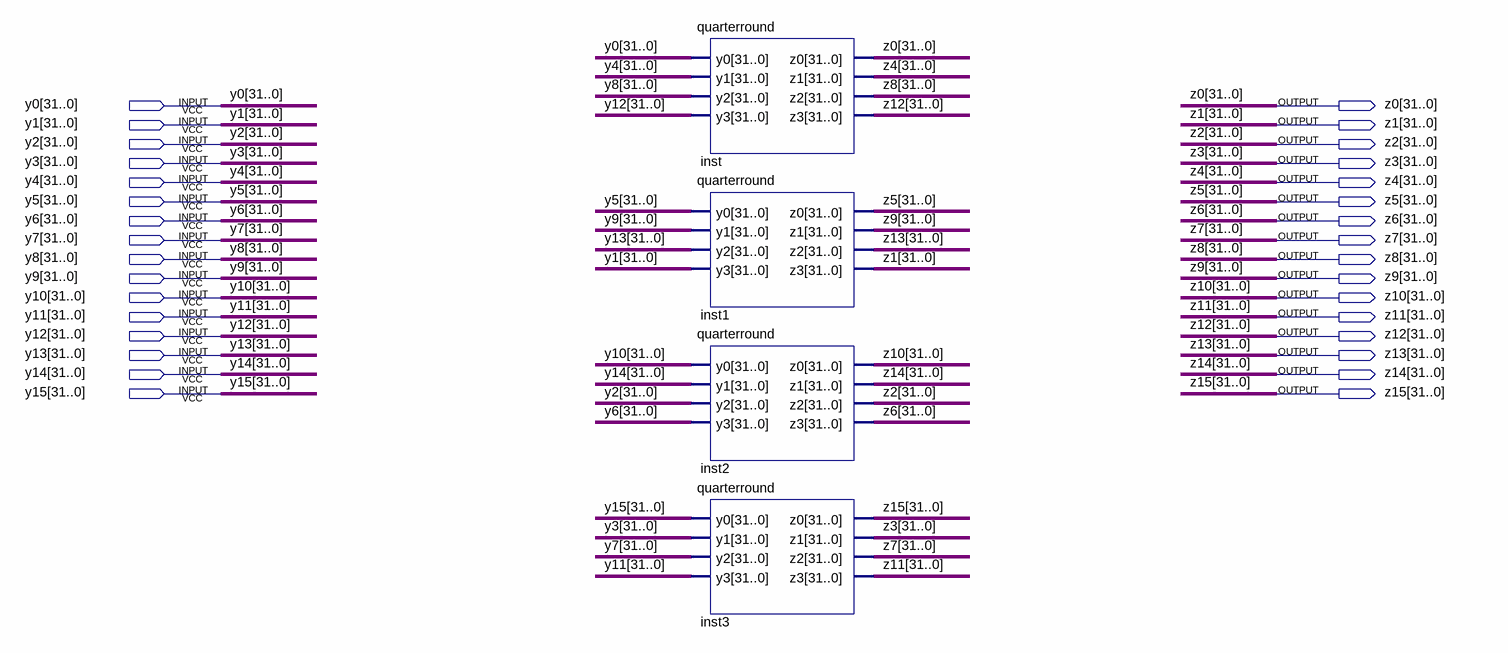
[diagram p0: schematic sheet]
// Quartus schematic columnround.bdf as structural Verilog: 4 symbols, 32 pins
module columnround (
  input  [31:0] y0,
  input  [31:0] y1,
  input  [31:0] y2,
  input  [31:0] y3,
  input  [31:0] y4,
  input  [31:0] y5,
  input  [31:0] y6,
  input  [31:0] y7,
  input  [31:0] y8,
  input  [31:0] y9,
  input  [31:0] y10,
  input  [31:0] y11,
  input  [31:0] y12,
  input  [31:0] y13,
  input  [31:0] y14,
  input  [31:0] y15,
  output [31:0] z0,
  output [31:0] z1,
  output [31:0] z2,
  output [31:0] z3,
  output [31:0] z4,
  output [31:0] z5,
  output [31:0] z6,
  output [31:0] z7,
  output [31:0] z8,
  output [31:0] z9,
  output [31:0] z10,
  output [31:0] z11,
  output [31:0] z12,
  output [31:0] z13,
  output [31:0] z14,
  output [31:0] z15
);

  quarterround inst (.y0(y0), .y1(y4), .y2(y8), .y3(y12), .z0(z0), .z1(z4), .z2(z8), .z3(z12));
  quarterround inst1 (.y0(y5), .y1(y9), .y2(y13), .y3(y1), .z0(z5), .z1(z9), .z2(z13), .z3(z1));
  quarterround inst2 (.y0(y10), .y1(y14), .y2(y2), .y3(y6), .z0(z10), .z1(z14), .z2(z2), .z3(z6));
  quarterround inst3 (.y0(y15), .y1(y3), .y2(y7), .y3(y11), .z0(z15), .z1(z3), .z2(z7), .z3(z11));
endmodule
